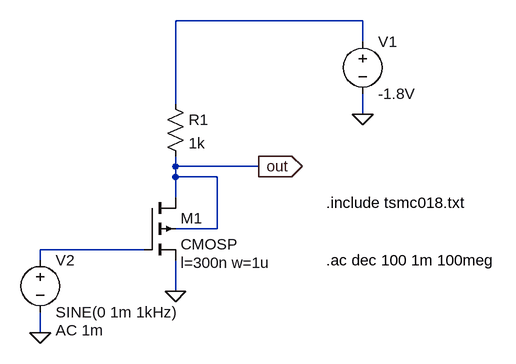
[diagram p0: schematic PMOS.asc]
PMOS.asc, the LTspice schematic file:
Version 4
SHEET 1 880 680
WIRE 544 -176 256 -176
WIRE 544 -144 544 -176
WIRE 256 -48 256 -176
WIRE 544 -32 544 -64
WIRE 256 48 256 32
WIRE 384 48 256 48
WIRE 256 64 256 48
WIRE 320 64 256 64
WIRE 256 96 256 64
WIRE 320 144 320 64
WIRE 320 144 256 144
WIRE 208 176 48 176
WIRE 48 192 48 176
WIRE 256 240 256 192
WIRE 48 304 48 272
FLAG 544 -32 0
FLAG 48 304 0
FLAG 256 240 0
FLAG 384 48 out
IOPIN 384 48 Out
SYMBOL pmos4 208 96 R0
WINDOW 123 56 100 Left 2
SYMATTR Value2 l=300n w=1u
SYMATTR InstName M1
SYMATTR Value CMOSP
SYMBOL voltage 544 -160 R0
WINDOW 123 0 0 Left 0
WINDOW 39 0 0 Left 0
SYMATTR InstName V1
SYMATTR Value -1.8V
SYMBOL voltage 48 176 R0
WINDOW 123 24 124 Left 2
WINDOW 39 0 0 Left 0
SYMATTR Value2 AC 1m
SYMATTR InstName V2
SYMATTR Value SINE(0 1m 1kHz)
SYMBOL res 240 -64 R0
SYMATTR InstName R1
SYMATTR Value 1k
TEXT 488 104 Left 2 !.include tsmc018.txt
TEXT 488 192 Left 2 !.ac dec 100 1m 100meg

The netlist it stands for:
* PMOS.asc
M1 out N002 0 out CMOSP l=300n w=1u
V1 N001 0 -1.8V
V2 N002 0 SINE(0 1m 1kHz) AC 1m
R1 N001 out 1k
.model NMOS NMOS
.model PMOS PMOS
.lib standard.mos
.include tsmc018.txt
.ac dec 100 1m 100meg
.backanno
.end